# Altium schematic sheet Sumo_Motor_Stepper_DC_TopLevel.SCHDOC
size A
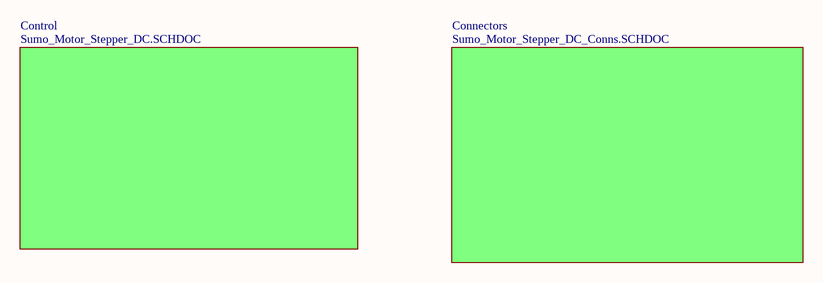
[diagram p0: Sumo_Motor_Stepper_DC_TopLevel.SCHDOC]

## Sub-sheets
Connectors = Sumo_Motor_Stepper_DC_Conns.SCHDOC: no entries
Control = Sumo_Motor_Stepper_DC.SCHDOC: no entries